# EAGLE design ENC_BOARD_V01 (EAGLE 9.5.2)
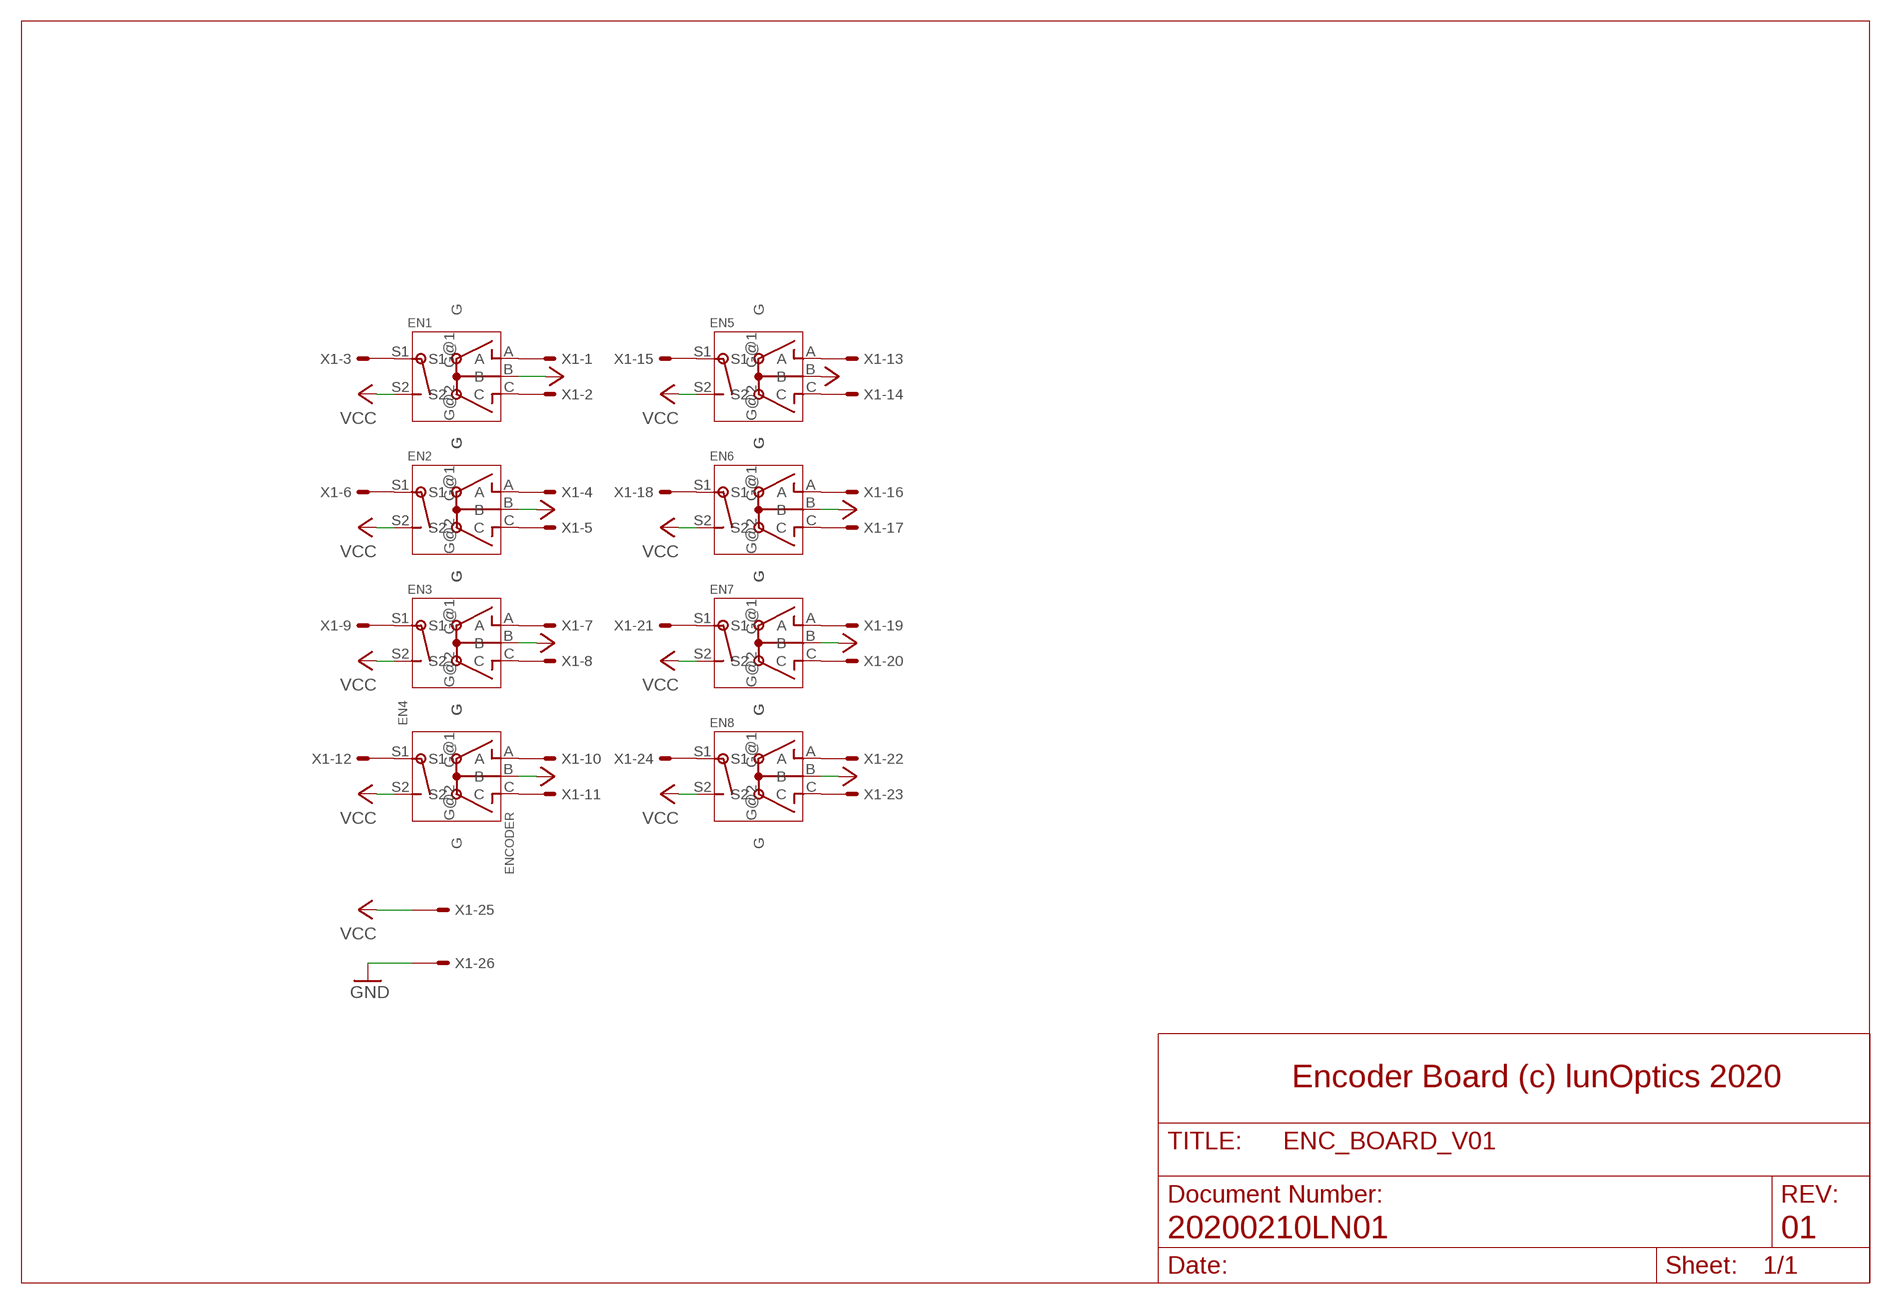
[diagram p0: schematic, sheet 1]

## Parts
EN1  ENCODER  [ENCODER]
EN2  ENCODER  [ENCODER]
EN3  ENCODER  [ENCODER]
EN4  ENCODER  [ENCODER]
EN5  ENCODER  [ENCODER]
EN6  ENCODER  [ENCODER]
EN7  ENCODER  [ENCODER]
EN8  ENCODER  [ENCODER]
X1  057-026-1  [057-026-1]

## Nets
GND [supply]: X1.26
N$1: EN1.A X1.1
N$2: EN1.C X1.2
N$3: EN1.S1 X1.3
N$4: EN2.A X1.4
N$5: EN2.C X1.5
N$6: EN2.S1 X1.6
N$7: EN3.A X1.7
N$8: EN3.C X1.8
N$9: EN3.S1 X1.9
N$10: EN4.A X1.10
N$11: EN4.C X1.11
N$12: EN4.S1 X1.12
N$13: EN5.A X1.13
N$14: EN5.C X1.14
N$15: EN5.S1 X1.15
N$16: EN6.A X1.16
N$17: EN6.C X1.17
N$18: EN6.S1 X1.18
N$19: EN7.A X1.19
N$20: EN7.C X1.20
N$21: EN7.S1 X1.21
N$22: EN8.A X1.22
N$23: EN8.C X1.23
N$24: EN8.S1 X1.24
VCC [supply]: EN1.B EN1.S2 EN2.B EN2.S2 EN3.B EN3.S2 EN4.B EN4.S2 EN5.B EN5.S2 EN6.B EN6.S2 EN7.B EN7.S2 EN8.B EN8.S2 X1.25
Unconnected: EN1.G@1(G) EN1.G@2(G) EN2.G@1(G) EN2.G@2(G) EN3.G@1(G) EN3.G@2(G) EN4.G@1(G) EN4.G@2(G) EN5.G@1(G) EN5.G@2(G) EN6.G@1(G) EN6.G@2(G) EN7.G@1(G) EN7.G@2(G) EN8.G@1(G) EN8.G@2(G)

## Notes on the sheet
- Encoder Board (c) lunOptics 2020
- 20200210LN01 | 01

## Library data of the parts
EN1-EN8 = misc:ENCODER
X1 = con-panduit:057-026-: CONNECTOR 20-pin series 057 contact pc board low profile headers; OC_FARNELL: unknown; OC_NEWARK: unknown

## Net classes
1 supply: width 0.381 mm

## Board
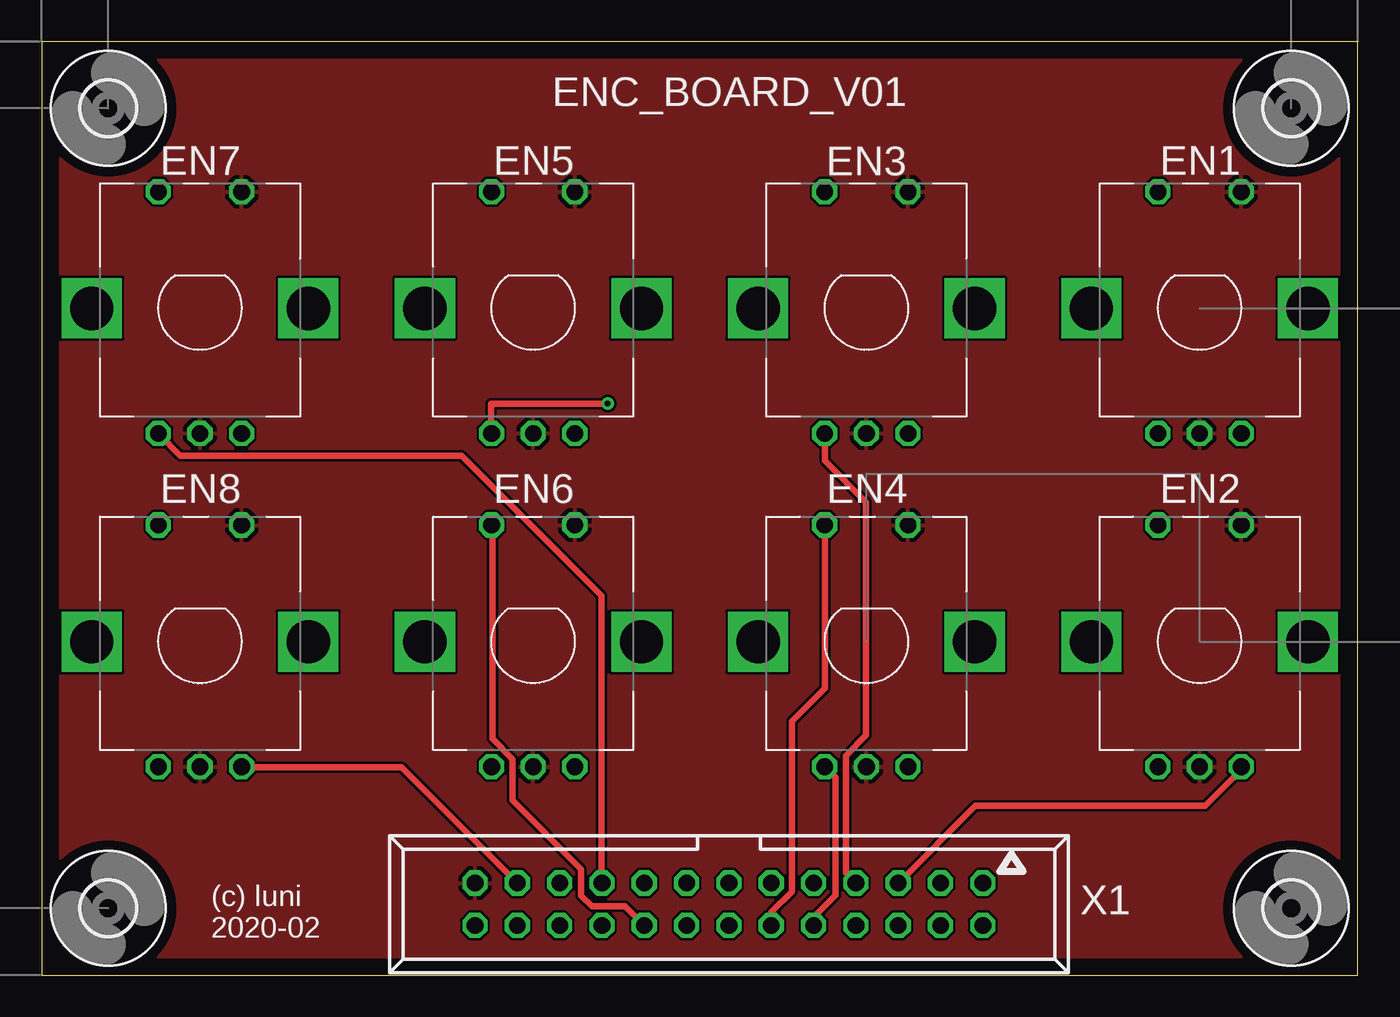
[diagram p1: board, top side]
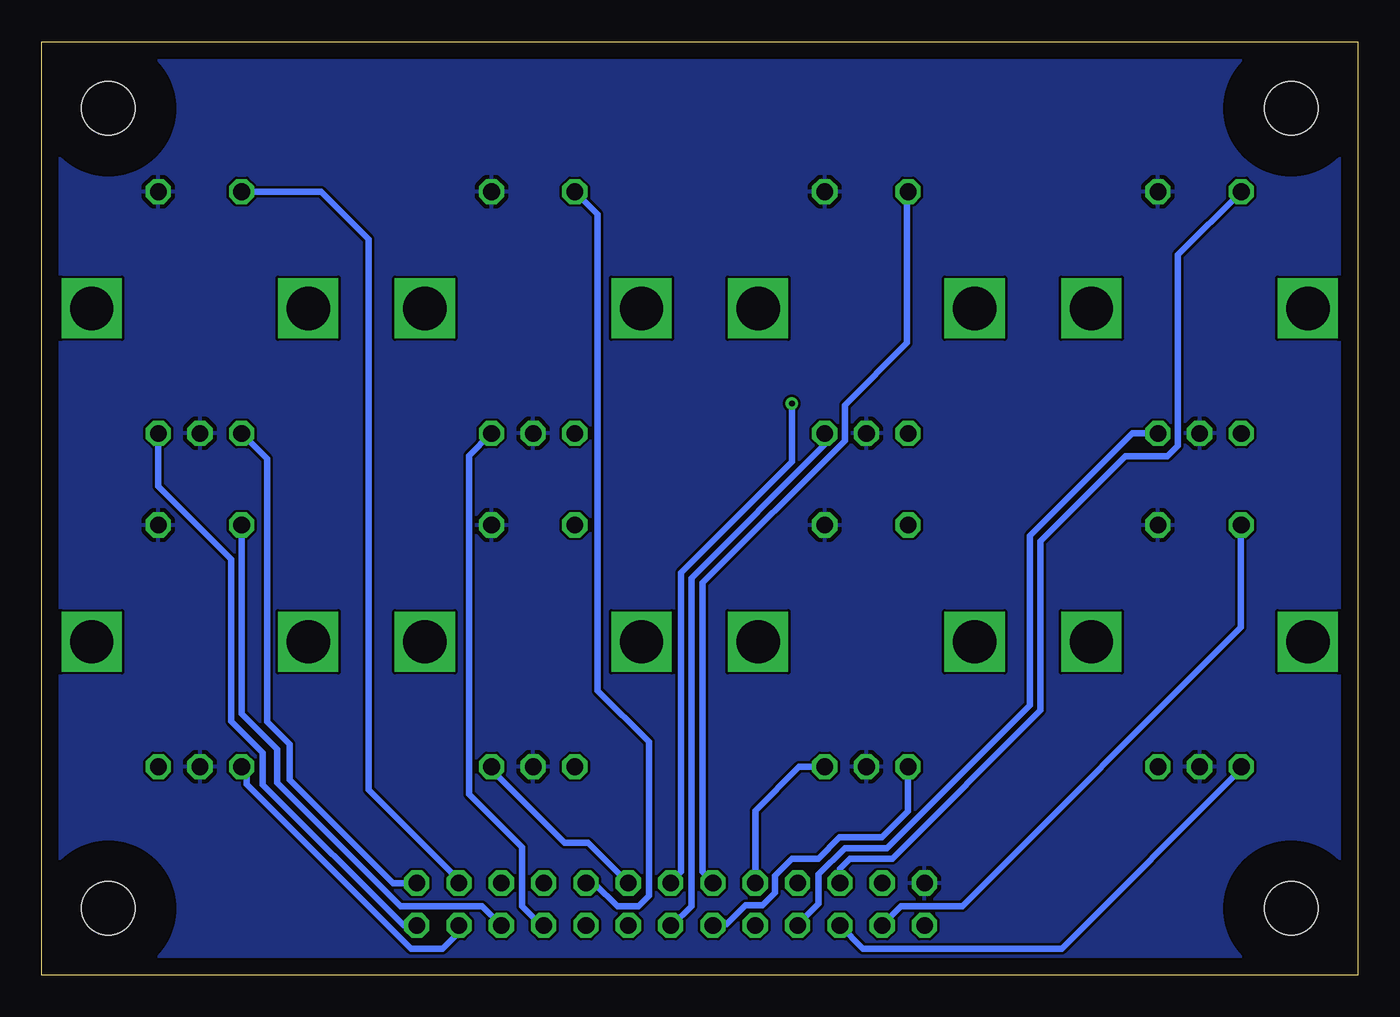
[diagram p2: board, bottom side, seen from below]

Size 79 x 56 mm. Coordinates in mm from the lower left corner, seen from the top.
Outline: 0,0 79,0 79,56 0,56 0,0
Copper layers (1*16): Top 0.035mm / dielectric 1.5mm / Bottom 0.035mm
Design rules "default": minimum track width 6mil, minimum drill 0.35mm, track to track 6mil, track to pad 6mil, pad to pad 6mil, via to via 6mil, smd to smd 6mil, copper to edge 40mil, drill to drill 6mil, minimum pad ring 10mil, minimum via ring 8mil, stop-mask expansion 4mil, vias tented up to drill 0mil, thermal gap 10mil

### Footprints (pad centres in the part's own frame; a part is rotated, then mirrored left to right if it is on the bottom)
ENCODER = drill 1 octagon: A -2.5,-7.5; B 0,-7.5; C 2.5,-7.5; S1 -2.5,7; S2 2.5,7 | drill 2.6 square: G@1 -6.5,0; G@2 6.5,0
3,2 = hole 3.2: 0,0
057-026-1 = drill 1 octagon: 1 -15.24,-1.27; 2 -15.24,1.27; 3 -12.7,-1.27; 4 -12.7,1.27; 5 -10.16,-1.27; 6 -10.16,1.27; 7 -7.62,-1.27; 8 -7.62,1.27; 9 -5.08,-1.27; 10 -5.08,1.27; 11 -2.54,-1.27; 12 -2.54,1.27; 13 0,-1.27; 14 0,1.27; 15 2.54,-1.27; 16 2.54,1.27; 17 5.08,-1.27; 18 5.08,1.27; 19 7.62,-1.27; 20 7.62,1.27; 21 10.16,-1.27; 22 10.16,1.27; 23 12.7,-1.27; 24 12.7,1.27; 25 15.24,-1.27; 26 15.24,1.27

### Placement (x,y rotation side)
EN1  69.5,40 0 top
EN2  69.5,20 0 top
EN3  49.5,40 0 top
EN4  49.5,20 0 top
EN5  29.5,40 0 top
EN6  29.5,20 0 top
EN7  9.5,40 0 top
EN8  9.5,20 0 top
U$1  [3,2]  4,4 0 top
U$2  [3,2]  75,4 0 top
U$3  [3,2]  4,52 0 top
U$4  [3,2]  75,52 0 top
X1  41.25,4.25 180 top

### Tracks (layer width: path | path; a pad name or v marks a point on that pad's centre or on a via)
N$1
  Bottom 0.381: X1.1 57.91,5.52 64.11,11.72 64.11,13.83 65.47,15.19 65.47,30.97 EN1.A
N$2
  Bottom 0.381: X1.2 57.27,2.98 65.72,11.43 65.72,13.34 67.63,15.24 67.63,24.95 72,29.32 EN1.C
N$3
  Bottom 0.381: EN1.S1 62.24,47 59.37,44.13 59.37,11.11 53.95,5.69 X1.3
N$4
  Bottom 0.381: EN2.A 66.68,12.18 66.68,11.44 56.83,1.59 54.93,1.59 53.95,2.56 X1.4
N$5
  Top 0.381: X1.5 56.05,10.16 69.85,10.16 72,12.31 EN2.C
N$6
  Bottom 0.381: EN2.S1 67,15.68 64.87,13.56 64.87,11.53 57.47,4.13 52.56,4.13 X1.6
N$7
  Top 0.381: X1.7 48.26,6.13 48.26,13.15 49.48,14.37 49.48,28.37 47,30.84 EN3.A
N$8
  Bottom 0.152: 52.05,32.46 EN3.C
  Bottom 0.381: X1.8 49.02,2.98 50.16,4.13 50.16,7.66 53.35,10.85 53.35,31.15 52.05,32.46
N$9
  Bottom 0.152: 46.33,5.49 X1.9
  Bottom 0.381: 46.33,5.49 45.81,5.49 44.45,4.13 43.18,4.13 42.55,4.76 42.55,13.98 45.63,17.07 45.63,45.63 EN3.S1
N$10
  Top 0.152: 46.41,3.05 X1.10
  Top 0.381: 46.41,3.05 46.41,3.56 47.64,4.79 47.64,11.87 47.01,12.5 EN4.A
N$11
  Bottom 0.152: EN4.C 52,12.31
  Bottom 0.381: X1.11 46.21,7.94 47.62,7.94 52,12.31
N$12
  Top 0.152: 43.81,3.05 X1.12
  Top 0.381: 43.81,3.05 43.81,3.8 45.02,5 45.02,15.21 47,17.19 EN4.S1
N$13  (via drill 0.35)
  Top 0.381: v33.97,34.29 26.99,34.29 26.99,32.51 EN5.A
  Bottom 0.381: X1.13 41.25,5.58 40.64,6.19 40.64,24.13 33.97,30.8 v33.97,34.29
N$14
  Bottom 0.152: 32,32.46 EN5.C
  Bottom 0.381: 32,32.46 32,31.81 40.01,23.81 40.01,4.13 41.15,2.98 X1.14
N$15
  Bottom 0.152: 27.05,46.94 EN5.S1 | 38.71,5.56 X1.15
  Bottom 0.381: 27.05,46.94 27.05,37.94 30.8,34.19 30.8,32.07 39.34,23.52 39.34,6.2 38.71,5.56
N$16
  Bottom 0.152: 38.71,3.05 X1.16
  Bottom 0.381: 38.71,3.05 37.88,3.05 36.75,4.18 35.74,4.18 34.99,4.93 34.99,5.97 33.97,6.99 32.38,6.99 31.11,8.26 28.57,8.26 27,9.83 EN6.A
N$17
  Bottom 0.381: X1.17 36.17,9.87 33.54,12.5 EN6.C
N$18
  Top 0.152: 27.05,26.98 EN6.S1
  Top 0.381: 27.05,26.98 27.05,14.16 28.26,12.95 28.26,10.48 32.38,6.35 32.38,4.76 33.02,4.13 35.02,4.13 X1.18
N$19
  Top 0.152: 33.6,5.56 X1.19 | 7.01,32.46 EN7.A
  Top 0.381: 33.6,5.56 33.6,22.75 25.2,31.15 8.32,31.15 7.01,32.46
N$20
  Bottom 0.152: 33.6,3.05 X1.20
  Bottom 0.381: 33.6,3.05 32.38,4.27 32.38,6.03 30.8,7.62 28.26,7.62 19.68,16.19 19.68,26.35 13.54,32.5 EN7.C
N$21
  Bottom 0.381: X1.21 31.09,6.38 30.48,6.99 27.94,6.99 19.05,15.88 19.05,26.04 13.97,31.11 11.43,31.11 10.79,31.75 10.79,43.2 EN7.S1
N$22
  Bottom 0.381: X1.22 29.7,1.59 17.78,1.59 7,12.37 EN8.A
N$23
  Top 0.381: X1.23 21.6,12.47 12.03,12.47 EN8.C
N$24
  Bottom 0.152: 7.01,26.98 EN8.S1 | 28.5,3.05 X1.24
  Bottom 0.381: 7.01,26.98 7.01,20.87 23.75,4.13 27.42,4.13 28.5,3.05
VCC
  pour Top: -2.5,57.5 82.5,57.5 82.5,-2.5 -2.5,-2.5
  pour Bottom: -2.5,57.5 82.5,57.5 82.5,-2.5 -2.5,-2.5

### Text on the board
tPlace: ENC_BOARD_V01 | (c) luni / 2020-02